# Altium schematic sheet ULN2003.SchDoc
size A; SheetNumber: 10; SheetTotal: 10
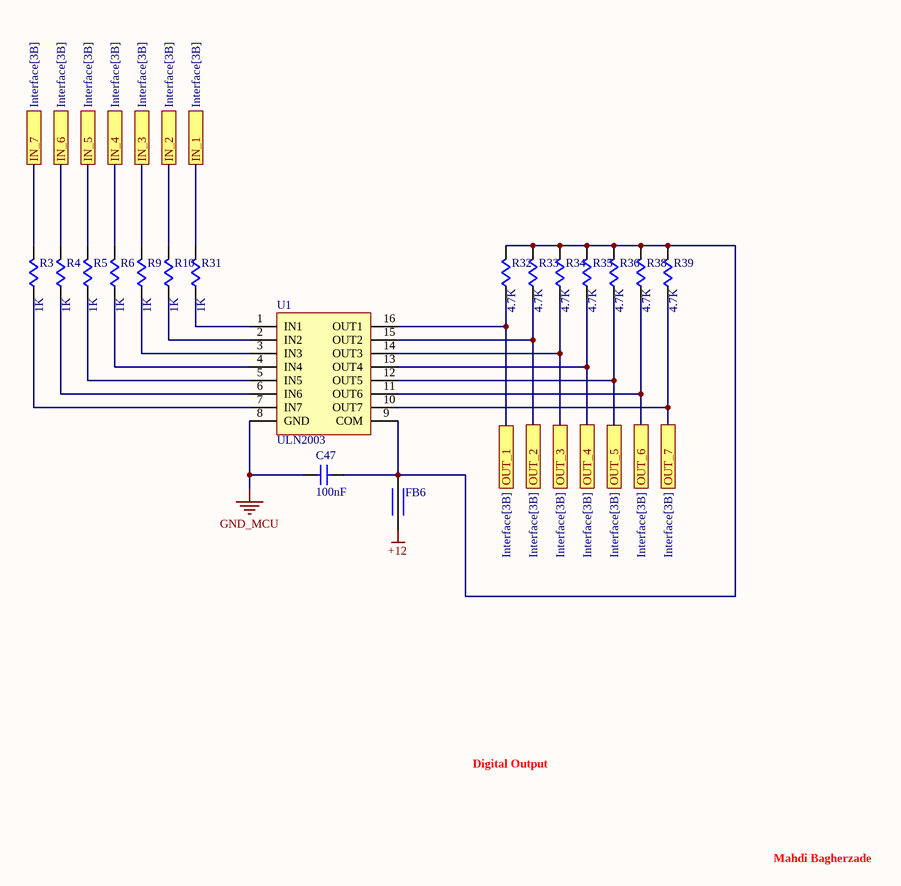
[diagram p0: ULN2003.SchDoc]

## Parts
C47  value 100nF  [C-0805]  (hidden comment: CAP Cer 100nF-50V-X7R-SMD)
FB6  Ferrite Bead SMD  [FB-0805]  (value not drawn)
R3  value 1K  [R-0805]  (hidden comment: RES 1K-5%-1/8W-SMD)
R4  value 1K  [R-0805]  (hidden comment: RES 1K-5%-1/8W-SMD)
R5  value 1K  [R-0805]  (hidden comment: RES 1K-5%-1/8W-SMD)
R6  value 1K  [R-0805]  (hidden comment: RES 1K-5%-1/8W-SMD)
R9  value 1K  [R-0805]  (hidden comment: RES 1K-5%-1/8W-SMD)
R10  value 1K  [R-0805]  (hidden comment: RES 1K-5%-1/8W-SMD)
R31  value 1K  [R-0805]  (hidden comment: RES 1K-5%-1/8W-SMD)
R32  value 4.7K  [R-0805]  (hidden comment: RES 4.7K-5%-1/8W-SMD)
R33  value 4.7K  [R-0805]  (hidden comment: RES 4.7K-5%-1/8W-SMD)
R34  value 4.7K  [R-0805]  (hidden comment: RES 4.7K-5%-1/8W-SMD)
R35  value 4.7K  [R-0805]  (hidden comment: RES 4.7K-5%-1/8W-SMD)
R36  value 4.7K  [R-0805]  (hidden comment: RES 4.7K-5%-1/8W-SMD)
R38  value 4.7K  [R-0805]  (hidden comment: RES 4.7K-5%-1/8W-SMD)
R39  value 4.7K  [R-0805]  (hidden comment: RES 4.7K-5%-1/8W-SMD)
U1  ULN2003  [SOIC16]

## Ports
IN_1 (see Interface[3B]), IN_2 (see Interface[3B]), IN_3 (see Interface[3B]), IN_4 (see Interface[3B]), IN_5 (see Interface[3B]), IN_6 (see Interface[3B]), IN_7 (see Interface[3B]), OUT_1 (see Interface[3B]), OUT_2 (see Interface[3B]), OUT_3 (see Interface[3B]), OUT_4 (see Interface[3B]), OUT_5 (see Interface[3B]), OUT_6 (see Interface[3B]), OUT_7 (see Interface[3B])

## Nets
+12: FB6.1
GND_MCU: C47.1 U1.8(GND)
IN_1: R31.2 ; port IN_1
IN_2: R10.2 ; port IN_2
IN_3: R9.2 ; port IN_3
IN_4: R6.2 ; port IN_4
IN_5: R5.2 ; port IN_5
IN_6: R4.2 ; port IN_6
IN_7: R3.2 ; port IN_7
OUT_1: R32.1 U1.16(OUT1) ; port OUT_1
OUT_2: R33.1 U1.15(OUT2) ; port OUT_2
OUT_3: R34.1 U1.14(OUT3) ; port OUT_3
OUT_4: R35.1 U1.13(OUT4) ; port OUT_4
OUT_5: R36.1 U1.12(OUT5) ; port OUT_5
OUT_6: R38.1 U1.11(OUT6) ; port OUT_6
OUT_7: R39.1 U1.10(OUT7) ; port OUT_7
NetC47_2: C47.2 FB6.2 R32.2 R33.2 R34.2 R35.2 R36.2 R38.2 R39.2 U1.9(COM)
NetR3_1: R3.1 U1.7(IN7)
NetR4_1: R4.1 U1.6(IN6)
NetR5_1: R5.1 U1.5(IN5)
NetR6_1: R6.1 U1.4(IN4)
NetR9_1: R9.1 U1.3(IN3)
NetR10_1: R10.1 U1.2(IN2)
NetR31_1: R31.1 U1.1(IN1)

## Notes on the sheet
- Digital Output
- Mahdi Bagherzade

## Library data of the parts
C47 = CAP-CER: CAPACITOR; Phone Number: 0915 8700 314; Voltage: 50V; Tolerance: X7R; Type: SMD; Publisher: Mahdi Bagherzadeh; ComponentLink1Description: Linkedin; ComponentLink1URL: https://ir.linkedin.com/in/mahdi-bagherzade; Published Date: 9-15-2024
FB6 = FERRITE BEAD: INDUCATOR; Phone Number: 0915 8700 314; Publisher: Mahdi Bagherzadeh; ComponentLink1Description: Linkedin; ComponentLink1URL: https://ir.linkedin.com/in/mahdi-bagherzade; Published Date: 9-15-2024; Type: SMD
R3-R6 R9 R10 R31-R36 R38 R39 = RES: RESISTOR; Phone Number: 0915 8700 314; Power: 1/8W; Tolerance: 5%; Publisher: Mahdi Bagherzadeh; ComponentLink1Description: Linkedin; ComponentLink1URL: https://ir.linkedin.com/in/mahdi-bagherzade; Published Date: 9-15-2024; Type: SMD
U1 = ULN2003: IC; Phone Number: 0915 8700 314; Publisher: Mahdi Bagherzadeh; ComponentLink1Description: Linkedin; ComponentLink1URL: https://ir.linkedin.com/in/mahdi-bagherzade; Published Date: 9-15-2024